# EAGLE design kid-v2 (EAGLE 9.1.3)
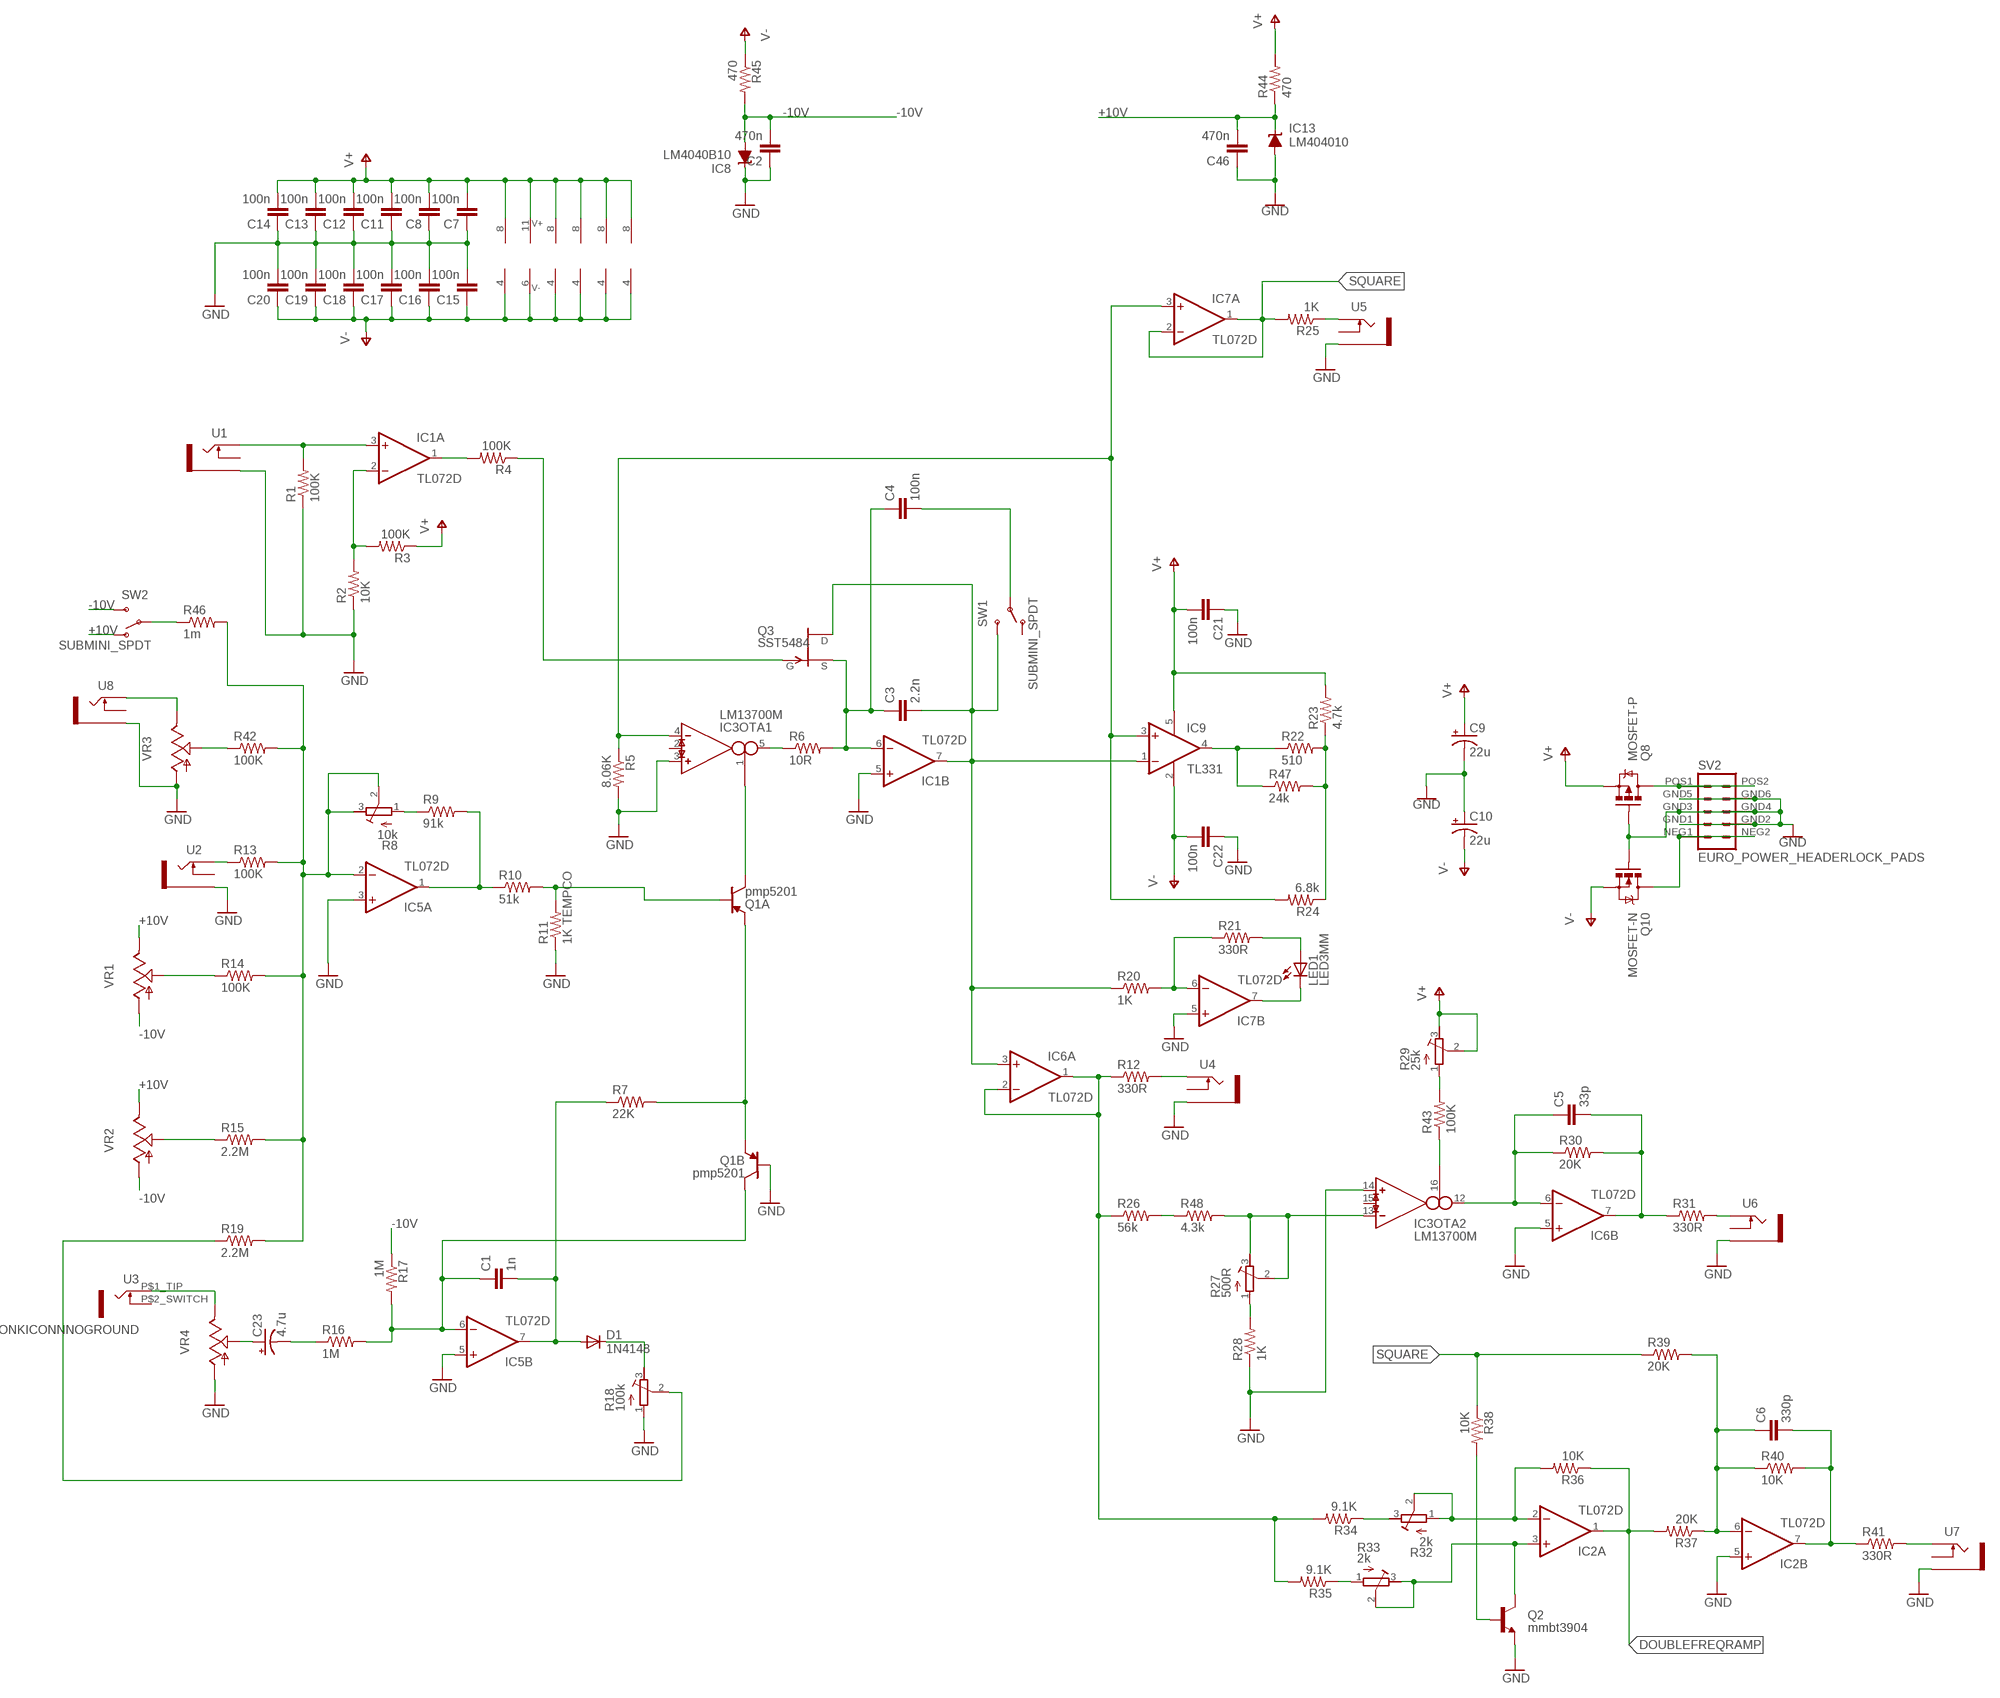
[diagram p0: schematic, sheet 1]

## Parts
C1  1n  C-EUC0603  [C0603]
C2  470n  CAP0603-CAP  [0603-CAP]
C3  2.2n  C-EUC0603  [C0603]
C4  100n  C-EUC0603  [C0603]
C5  33p  C-EUC0603  [C0603]
C6  330p  C-EUC0603  [C0603]
C7  100n  C-EUC0603  [C0603]
C8  100n  C-EUC0603  [C0603]
C9  22u  CPOL-USC  [PANASONIC_C]
C10  22u  CPOL-USC  [PANASONIC_C]
C11  100n  C-EUC0603  [C0603]
C12  100n  C-EUC0603  [C0603]
C13  100n  C-EUC0603  [C0603]
C14  100n  C-EUC0603  [C0603]
C15  100n  C-EUC0603  [C0603]
C16  100n  C-EUC0603  [C0603]
C17  100n  C-EUC0603  [C0603]
C18  100n  C-EUC0603  [C0603]
C19  100n  C-EUC0603  [C0603]
C20  100n  C-EUC0603  [C0603]
C21  100n  C-EUC0603  [C0603]
C22  100n  C-EUC0603  [C0603]
C23  4.7u  CPOL-USB  [PANASONIC_B]
C46  470n  CAP0603-CAP  [0603-CAP]
D1  1N4148  DIODESOD  [SOD-323]
IC1  TL072D  [SO08]
IC2  TL072D  [SO08]
IC3  LM13700M  [SO16]
IC5  TL072D  [SO08]
IC6  TL072D  [SO08]
IC7  TL072D  [SO08]
IC8  LM4040B10  LM4041B12DBZ  [DBZ_R-PDSO-G3]
IC9  TL331  [DBV-R-PDSO-G5]
IC13  LM404010  LM4041D12DBZ  [DBZ_R-PDSO-G3]
LED1  LED3MM  [LED3MM]
Q1  pmp5201  PNP-DUALPMP5201  [SOT363]
Q2  mmbt3904  TRANSISTOR_NPNSOT23  [SOT23]
Q3  SST5484  [SOT23]
Q8  MOSFET-P  [SOT23-3]
Q10  MOSFET-N  [SOT23-3]
R1  100K  R-US_R0603  [R0603]
R2  10K  R-US_R0603  [R0603]
R3  100K  R-US_R0603  [R0603]
R4  100K  R-US_R0603  [R0603]
R5  8.06K  R-US_R0603  [R0603]
R6  10R  R-US_R0603  [R0603]
R7  22K  R-US_R0603  [R0603]
R8  10k  R-TRIMM3296W  [RTRIM3296W]
R9  91k  R-US_R0603  [R0603]
R10  51k  R-US_R0603  [R0603]
R11  1K TEMPCO  R-US_R0805  [R0805]
R12  330R  R-US_R0603  [R0603]
R13  100K  R-US_R0603  [R0603]
R14  100K  R-US_R0603  [R0603]
R15  2.2M  R-US_R0603  [R0603]
R16  1M  R-US_R0603  [R0603]
R17  1M  R-US_R0603  [R0603]
R18  100k  R-TRIMM3296W  [RTRIM3296W]
R19  2.2M  R-US_R0603  [R0603]
R20  1K  R-US_R0603  [R0603]
R21  330R  R-US_R0603  [R0603]
R22  510  R-US_R0603  [R0603]
R23  4.7k  R-US_R0603  [R0603]
R24  6.8k  R-US_R0603  [R0603]
R25  1K  R-US_R0603  [R0603]
R26  56k  R-US_R0603  [R0603]
R27  500R  R-TRIMM3296W  [RTRIM3296W]
R28  1K  R-US_R0603  [R0603]
R29  25k  R-TRIMM3296W  [RTRIM3296W]
R30  20K  R-US_R0603  [R0603]
R31  330R  R-US_R0603  [R0603]
R32  2k  R-TRIMM3296W  [RTRIM3296W]
R33  2k  R-TRIMM3296W  [RTRIM3296W]
R34  9.1K  R-US_R0603  [R0603]
R35  9.1K  R-US_R0603  [R0603]
R36  10K  R-US_R0603  [R0603]
R37  20K  R-US_R0603  [R0603]
R38  10K  R-US_R0603  [R0603]
R39  20K  R-US_R0603  [R0603]
R40  10K  R-US_R0603  [R0603]
R41  330R  R-US_R0603  [R0603]
R42  100K  R-US_R0603  [R0603]
R43  100K  R-US_R0603  [R0603]
R44  470  RESISTOR0603-RES  [0603-RES]
R45  470  R-US_R0603  [R0603]
R46  1m  R-US_R0603  [R0603]
R47  24k  R-US_R0603  [R0603]
R48  4.3k  R-US_R0603  [R0603]
SV2  EURO_POWER_HEADERLOCK_PADS  [EURO_PWR_HEADER_LOCK]
SW1  SUBMINI_SPDT  [SUBMINI_TOGGLE]
SW2  SUBMINI_SPDT  [SUBMINI_TOGGLE]
U1  THONKICONNNEW  [WQP-PJ301M-12_JACK]
U2  THONKICONNNEW  [WQP-PJ301M-12_JACK]
U3  THONKICONNNOGROUND  [THONKICONNNOGROUND]
U4  THONKICONNNEW  [WQP-PJ301M-12_JACK]
U5  THONKICONNNEW  [WQP-PJ301M-12_JACK]
U6  THONKICONNNEW  [WQP-PJ301M-12_JACK]
U7  THONKICONNNEW  [WQP-PJ301M-12_JACK]
U8  THONKICONNNEW  [WQP-PJ301M-12_JACK]
VR1  9MM_SNAP-IN_POT_  [9MM_SNAP-IN_POT]
VR2  9MM_SNAP-IN_POT_  [9MM_SNAP-IN_POT]
VR3  9MM_SNAP-IN_POT_  [9MM_SNAP-IN_POT]
VR4  9MM_SNAP-IN_POT_  [9MM_SNAP-IN_POT]

## Nets
+10V: C46.2 IC13.1(C) R44.1 SW2.1(O) VR1.3(E) VR2.3(E)
-10V: C2.2 IC8.2(A) R17.1 R45.2 SW2.3(S) VR1.1(A) VR2.1(A)
DOUBLEFREQRAMP: IC2.1(A:OUT) R36.1 R37.2
GND: C2.1 C7.1 C8.1 C9.- C10.+ C11.1 C12.1 C13.1 C14.1 C15.2 C16.2 C17.2 C18.2 C19.2 C20.2 C21.1 C22.1 C46.1 IC1.5(B:+IN) IC2.5(B:+IN) IC3.3(OTA1:IN_P) IC3.14(OTA2:IN_P) IC5.3(A:+IN) IC5.5(B:+IN) IC6.5(B:+IN) IC7.5(B:+IN) IC8.1(C) IC13.2(A) Q1.P$2(B:B) Q2.2(E) Q8.1(G) Q10.1(G) R1.1 R2.1 R5.2 R11.1 R18.1(A) R28.1 SV2.GND1 SV2.GND2 SV2.GND3 SV2.GND4 SV2.GND5 SV2.GND6 U1.P$3_SLEEVE(SLEEVE) U2.P$3_SLEEVE(SLEEVE) U4.P$3_SLEEVE(SLEEVE) U5.P$3_SLEEVE(SLEEVE) U6.P$3_SLEEVE(SLEEVE) U7.P$3_SLEEVE(SLEEVE) U8.P$3_SLEEVE(SLEEVE) VR3.1(A) VR4.1(A)
N$1: IC1.3(A:+IN) R1.2 U1.P$1_TIP(TIP)
N$2: R26.2 R48.1
N$3: IC1.2(A:-IN) R2.2 R3.2
N$4: IC3.4(OTA1:IN_N) IC7.3(A:+IN) IC9.3(+IN) R5.1 R24.2
N$6: IC1.1(A:OUT) R4.2
N$7: IC3.5(OTA1:OUT) R6.1
N$8: C3.1 C4.1 IC1.6(B:-IN) Q3.2(S) R6.2
N$9: IC3.1(OTA1:I_BIAS) Q1.P$6(A:C)
N$10: Q1.P$4(B:E) Q1.P$5(A:E) R7.2
N$11: Q1.P$1(A:B) R10.2 R11.2
N$13: IC5.1(A:OUT) R9.2 R10.1
N$14: R15.1 VR2.2(S)
N$15: Q3.3(G) R4.1
N$16: R14.1 VR1.2(S)
N$17: R13.1 U2.P$1_TIP(TIP)
N$18: C1.1 IC5.6(B:-IN) Q1.P$3(B:C) R16.2 R17.2
N$19: C23.+ VR4.2(S)
N$20: C23.- R16.1
N$21: C1.2 D1.2(A) IC5.7(B:OUT) R7.1
N$22: D1.1(C) R18.3(E)
N$23: R18.2(S) R19.1
N$24: U3.P$1_TIP VR4.3(E)
N$25: C3.2 IC1.7(B:OUT) IC6.3(A:+IN) IC9.1(-IN) Q3.1(D) R20.1 SW1.3(S)
N$26: C4.2 SW1.COM(COMMON)
N$27: IC3.13(OTA2:IN_N) R27.2(S) R27.3(E) R48.2
N$28: IC6.1(A:OUT) IC6.2(A:-IN) R12.1 R26.1 R34.2 R35.2
N$29: R12.2 U4.P$1_TIP(TIP)
N$30: IC7.7(B:OUT) LED1.K(C)
N$31: IC7.6(B:-IN) R20.2 R21.1
N$32: LED1.A R21.2
N$33: R25.1 U5.P$1_TIP(TIP)
N$34: IC5.2(A:-IN) R8.2(S) R8.3(E) R13.2 R14.2 R15.2 R19.2 R42.2 R46.2
N$35: R22.2 R23.1 R24.1 R47.2
N$36: R27.1(A) R28.2
N$37: U8.P$1_TIP(TIP) VR3.3(E)
N$38: C5.1 IC3.12(OTA2:OUT) IC6.6(B:-IN) R30.1
N$39: R29.1(A) R43.2
N$40: R32.3(E) R34.1
N$41: R33.1(A) R35.1
N$42: C5.2 IC6.7(B:OUT) R30.2 R31.1
N$43: IC2.3(A:+IN) Q2.3(C) R33.2(S) R33.3(E)
N$44: R31.2 U6.P$1_TIP(TIP)
N$45: IC2.2(A:-IN) R32.1(A) R32.2(S) R36.2
N$48: Q2.1(B) R38.2
N$49: C6.2 IC2.7(B:OUT) R40.2 R41.1
N$50: R41.2 U7.P$1_TIP(TIP)
N$51: IC3.16(OTA2:I_BIAS) R43.1
N$52: R42.1 VR3.2(S)
N$53: R46.1 SW2.COM(COMMON)
N$54: IC9.4(OUT) R22.1 R47.1
N$55: Q8.3(D) SV2.POS1 SV2.POS2
N$56: R8.1(A) R9.1
N$58: Q10.3(D) SV2.NEG1 SV2.NEG2
REGSAW: C6.1 IC2.6(B:-IN) R37.1 R39.2 R40.1
SQUARE: IC7.1(A:OUT) IC7.2(A:-IN) R25.2 R38.1 R39.1
V+: C7.2 C8.2 C9.+ C11.2 C12.2 C13.2 C14.2 C21.2 IC1.8(P:V+) IC2.8(P:V+) IC3.11(SUPPLY:V+) IC5.8(P:V+) IC6.8(P:V+) IC7.8(P:V+) IC9.5(V+) Q8.2(S) R3.1 R23.2 R29.2(S) R29.3(E) R44.2
V-: C10.- C15.1 C16.1 C17.1 C18.1 C19.1 C20.1 C22.2 IC1.4(P:V-) IC2.4(P:V-) IC3.6(SUPPLY:V-) IC5.4(P:V-) IC6.4(P:V-) IC7.4(P:V-) IC9.2(GND) Q10.2(S) R45.1
Unconnected: IC3.2(OTA1:I_DIODE) IC3.7(BUF1:B) IC3.8(BUF1:E) IC3.9(BUF2:E) IC3.10(BUF2:B) IC3.15(OTA2:I_DIODE) SW1.1(O) U1.P$2_SWITCH(SWITCH) U2.P$2_SWITCH(SWITCH) U3.P$2_SWITCH U4.P$2_SWITCH(SWITCH) U5.P$2_SWITCH(SWITCH) U6.P$2_SWITCH(SWITCH) U7.P$2_SWITCH(SWITCH) U8.P$2_SWITCH(SWITCH)

## Library data of the parts
C1 C3-C8 C11-C22 = rcl:C-EU: CAPACITOR, European symbol; SPICEPREFIX: C
C2 C46 = SparkFun:CAP: Capacitor Standard 0603 ceramic capacitor, and 0.1" leaded capacitor.
C9 C10 C23 = rcl:CPOL-US: POLARIZED CAPACITOR, American symbol
D1 = SparkFun:DIODE: Diode These are standard reverse protection diodes and small signal diodes. SMA package can handle up to about 1A. SOD-323 can handle about 200mA. What the SOD-323 package when ordering, there are some mfgs out there that are 5-pin packages.
IC1 IC2 IC5-IC7 = gm-ics:TL072: OP AMP
IC3 = ota:LM13700: Dual OTA with buffers
IC8 = texas:LM4041: PRECISION MICROPOWER SHUNT VOLTAGE REFERENCE Source: http://focus.ti.com/lit/ds/slcs146e/slcs146e.pdf
IC9 = linear:TL331: SINGLE DIFFERENTIAL COMPARATOR Source: Data sheet <http://www.ti.com/lit/ds/symlink/tl331-q1.pdf>
IC13 = texas:LM4041: PRECISION MICROPOWER SHUNT VOLTAGE REFERENCE Source: http://focus.ti.com/lit/ds/slcs146e/slcs146e.pdf; MF: TEXAS INSTRUMENT CONNECTORS; MPN: LM4041D12QDBZT; OC_FARNELL: 1755118; OC_NEWARK: 43K3381
LED1 = audioint:LED
Q1 = audioint:PNP-DUAL
Q2 = SparkFun:TRANSISTOR_NPN: Transistor NPN BJT configuration in SOT23 package. MMBT2222 is the common NPN we use. Double check BCE configuration again layout.
Q3 = transistor-fet:?548*: N-Channel JFETs Source: VISHAY 2N5484.pdf Compatible: TO92 2N5245 J304 J305 U310 J308 J309 J310 TO72 2N4416 2N4416A 2N3823 2N4351 3N169 3N170 3N171 MFE3002 TO18 2N3796 2N3797 MFE825 Source: Motorola European Master Guide Pacge 3-59
Q8 = tc:MOSFET-P
Q10 = tc:MOSFET-N
R1-R7 R9-R17 R19-R26 R28 R30 R31 R34-R43 R46-R48 = rcl:R-US_: RESISTOR, American symbol; SPICEPREFIX: R
R8 R18 R27 R29 R32 R33 = rcl:R-TRIMM: Trimm resistor; SPICEMODEL: X; SPICEPREFIXL: POT
R44 = SparkFun:RESISTOR: Resistor Basic schematic elements and footprints for 0603, 1206, and PTH 1/10th watt (small) resistors.
R45 = rcl:R-US_: RESISTOR, American symbol
SV2 = MusicThingModular:EURO_POWER_HEADER: Power Header 10 pin power header for Eurorack Power Supplies Variants with fatter pads for easier soldering, and the LOCK variant which has 5mil offset pins to hold the component in place before soldering
SW1 SW2 = MusicThingModular:SUBMINI_SPDT
U1 U2 U4-U8 = MusicThingModular:THONKICONN: 3.5mm socket for Eurorack modular synths
U3 = tc:THONKICONNNOGROUND: Thonkiconn jack without ground tab
VR1-VR4 = MusicThingModular:9MM_SNAP-IN_POT: 9mm vertical snap-in pot, Alpha / Panasonic style

## Board
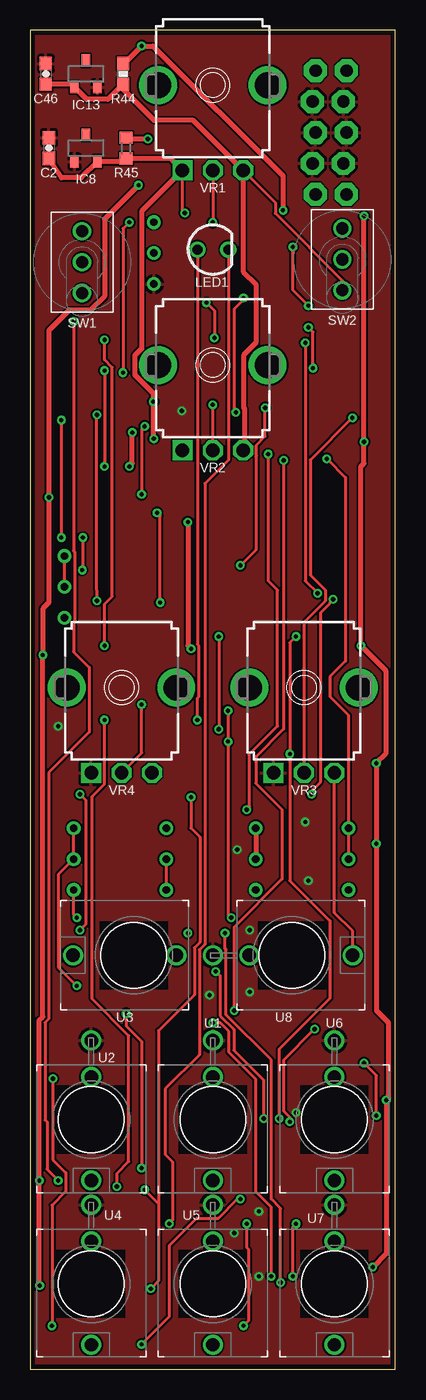
[diagram p1: board, top side]
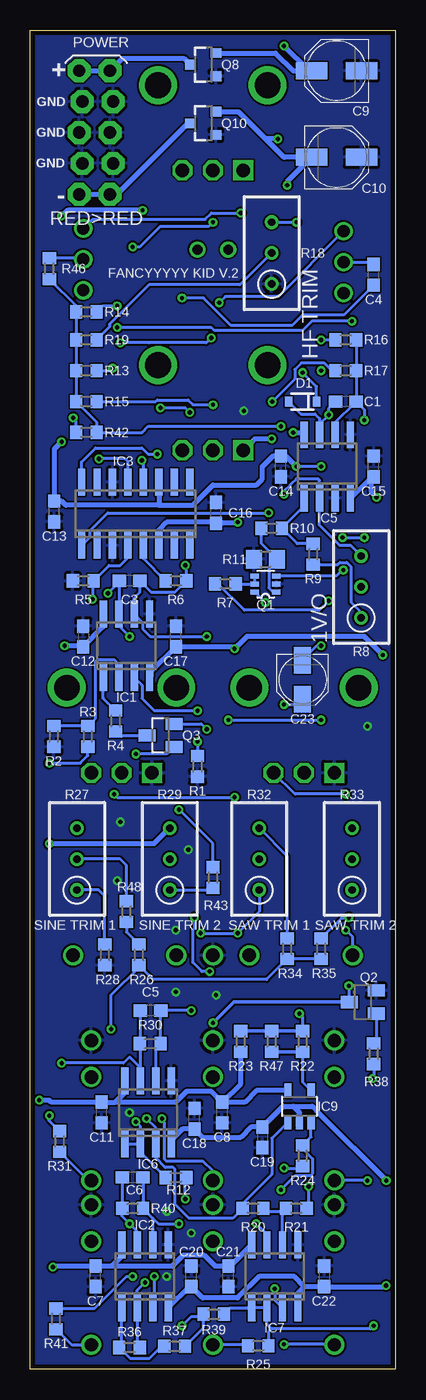
[diagram p2: board, bottom side, seen from below]

Size 30 x 110 mm. Coordinates in mm from the lower left corner, seen from the top.
Outline: 0,0 30,0 30,110 0,110 0,0
Copper layers (1*16): Top 0.0356mm / dielectric 1.5011mm / Bottom 0.0356mm
Design rules "LaenPCBOrder *": minimum track width 10mil, minimum drill 13mil, track to track 6mil, track to pad 6mil, pad to pad 6mil, via to via 6mil, smd to smd 6mil, copper to edge 15mil, drill to drill 6mil, minimum pad ring 10mil, minimum via ring 7mil, stop-mask expansion 3mil, vias tented up to drill 15mil, thermal gap 10mil

### Footprints (pad centres in the part's own frame; a part is rotated, then mirrored left to right if it is on the bottom)
C0603 = smd 1.1 x 1: 1 -0.85,0; 2 0.85,0
0603-CAP = smd 1.1 x 1: 1 -0.85,0; 2 0.85,0
PANASONIC_C = smd 2.6 x 1.4: + 2.05,0; - -2.05,0
PANASONIC_B = smd 2.2 x 1.4: + 1.6,0; - -1.6,0
SOD-323 = smd 0.63 x 0.83: 1 -1.15,0; 2 1.15,0
SO08 = smd 0.6 x 2.2: 1 -1.905,-2.6; 2 -0.635,-2.6; 3 0.635,-2.6; 4 1.905,-2.6; 5 1.905,2.6; 6 0.635,2.6; 7 -0.635,2.6; 8 -1.905,2.6
SO16 = smd 0.6 x 2.2: 1 -4.445,-2.6; 2 -3.175,-2.6; 3 -1.905,-2.6; 4 -0.635,-2.6; 5 0.635,-2.6; 6 1.905,-2.6; 7 3.175,-2.6; 8 4.445,-2.6; 9 4.445,2.6; 10 3.175,2.6; 11 1.905,2.6; 12 0.635,2.6; 13 -0.635,2.6; 14 -1.905,2.6; 15 -3.175,2.6; 16 -4.445,2.6
DBZ_R-PDSO-G3 = smd 0.7 x 1: 1 -0.95,-1.1; 2 0.95,-1.1; 3 0,1.1
DBV-R-PDSO-G5 = smd 0.6 x 1.2: 1 -0.95,-1.306; 2 0,-1.306; 3 0.95,-1.306; 4 0.95,1.306; 5 -0.95,1.306
LED3MM = drill 0.813: A -1.27,0; K 1.27,0
SOT363 = smd 0.42 x 0.7: P$1 -0.65,-0.9; P$2 0,-0.9; P$3 0.65,-0.9; P$4 0.65,0.9; P$5 0,0.9; P$6 -0.65,0.9
SOT23 = smd 1 x 1.4: 1 -0.95,-1.1; 2 0.95,-1.1; 3 0,1.1
SOT23-3 = smd 0.8 x 0.9: 1 -0.95,-1; 2 0.95,-1; 3 0,1.1
R0603 = smd 1 x 1.1: 1 -0.85,0; 2 0.85,0
RTRIM3296W = drill 0.61: 1 0,-2.54; 2 0,0; 3 0,2.54
R0805 = smd 1.3 x 1.5: 1 -0.95,0; 2 0.95,0
0603-RES = smd 1.1 x 1: 1 -0.85,0; 2 0.85,0
EURO_PWR_HEADER_LOCK = drill 1.016 pad 1.88 octagon: GND1 -2.54,1.143; GND2 -2.54,-1.397; GND3 0,1.397; GND4 0,-1.143; GND5 2.54,1.143; GND6 2.54,-1.397; NEG1 -5.08,1.397; NEG2 -5.08,-1.143; POS1 5.08,1.397; POS2 5.08,-1.143
SUBMINI_TOGGLE = drill 1 pad 1.422: 1 -2.54,0; 3 2.54,0; COM 0,0
WQP-PJ301M-12_JACK = drill 1.1: P$1_TIP 0,5; P$2_SWITCH 0,-3.5; P$3_SLEEVE 0,-6.5
THONKICONNNOGROUND = drill 1.1: P$1_TIP 0,5; P$2_SWITCH 0,-3.5
9MM_SNAP-IN_POT = drill 1.1 square: 1 -2.5,-7 | drill 1.1 octagon: 2 0,-7; 3 2.5,-7 | drill 2.1 pad 2.794: CHASSIS1 -4.5,0; CHASSIS2 4.5,0

### Placement (x,y rotation side)
C1  4.06,79.5 180 bottom
C2  1.52,100.33 270 top
C3  21.84,64.77 180 bottom
C4  1.78,89.92 90 bottom
C5  20.12,29.45 180 bottom
C6  21.59,15.75 180 bottom
C7  24.64,7.62 90 bottom
C8  14.22,21.08 90 bottom
C9  4.83,106.68 180 bottom
C10  4.83,99.57 0 bottom
C11  24.13,21.08 90 bottom
C12  25.65,60.2 270 bottom
C13  28.03,70.47 90 bottom
C14  9.4,74.17 90 bottom
C15  1.78,74.17 90 bottom
C16  14.73,70.36 90 bottom
C17  18.03,60.2 90 bottom
C18  16.51,20.57 90 bottom
C19  10.92,19.05 270 bottom
C20  16.76,7.62 90 bottom
C21  13.72,7.62 90 bottom
C22  5.84,7.62 270 bottom
C23  7.62,56.64 270 bottom
C46  1.27,106.43 270 top
D1  7.62,79.5 180 bottom
IC1  22.1,59.44 0 bottom
IC2  20.57,7.62 0 bottom
IC3  21.34,70.29 0 bottom
IC5  5.59,74.17 0 bottom
IC6  20.32,21.08 0 bottom
IC7  9.91,7.62 0 bottom
IC8  4.57,100.33 0 top
IC9  7.87,21.59 0 bottom
IC13  4.57,106.43 0 top
LED1  15,92 0 top
Q1  10.67,64.52 90 bottom
Q2  2.67,30.16 90 bottom
Q3  19.3,52.07 90 bottom
Q8  15.75,107.19 90 bottom
Q10  15.75,102.36 90 bottom
R1  16.26,49.53 90 bottom
R2  28.08,51.98 90 bottom
R3  25.28,51.98 90 bottom
R4  23,53.25 90 bottom
R5  25.65,64.77 180 bottom
R6  18.03,64.77 0 bottom
R7  13.97,64.52 0 bottom
R8  2.79,64.27 0 bottom
R9  6.74,66.97 90 bottom
R10  10.16,69.09 180 bottom
R11  10.67,66.55 0 bottom
R12  18.03,15.75 0 bottom
R13  25.4,82.04 180 bottom
R14  25.4,86.87 180 bottom
R15  25.4,79.5 180 bottom
R16  4.06,84.58 0 bottom
R17  4.06,82.04 0 bottom
R18  10.16,91.7 0 bottom
R19  25.4,84.58 180 bottom
R20  11.68,13.21 0 bottom
R21  8.13,13.21 0 bottom
R22  7.62,26.92 90 bottom
R23  12.7,26.92 270 bottom
R24  7.62,17.53 90 bottom
R25  11.26,1.91 0 bottom
R26  21.08,34.04 90 bottom
R27  26.16,41.91 0 bottom
R28  23.88,34.04 90 bottom
R29  18.54,41.91 0 bottom
R30  20.15,26.74 180 bottom
R31  27.59,18.71 270 bottom
R32  11.18,41.91 0 bottom
R33  3.56,41.91 0 bottom
R34  8.89,34.54 270 bottom
R35  6.1,34.54 270 bottom
R36  21.84,1.78 0 bottom
R37  18.14,1.87 180 bottom
R38  1.78,25.91 90 bottom
R39  14.92,4.51 180 bottom
R40  21.59,13.21 180 bottom
R41  27.89,4.13 270 bottom
R42  25.4,76.96 0 bottom
R43  14.99,40.39 270 bottom
R44  7.62,106.43 90 top
R45  7.87,100.33 270 top
R46  28.45,90.42 270 bottom
R47  10.16,26.92 90 bottom
R48  22.1,37.59 90 bottom
SV2  24.59,101.61 90 bottom
SW1  4.25,90.96 90 top
SW2  25.65,91.19 90 top
U1  15,20.5 180 top
U2  5,20.5 180 top
U3  8.5,34 90 top
U4  5,7 180 top
U5  15,7 180 top
U6  25,20.5 180 top
U7  25,7 180 top
U8  21.5,34 270 top
VR1  15,105.5 0 top
VR2  15,82.5 0 top
VR3  22.5,56 0 top
VR4  7.5,56 0 top

### Tracks (layer width: path | path; a pad name or v marks a point on that pad's centre or on a via)
+10V
  Top 0.254: VR1.3 20.14,95.86 20.14,94.96 25.65,89.45 SW2.1
  Top 0.406: VR2.3 17.61,75.61 17.61,78.91 17.53,78.99 17.53,83.31 18.54,84.33 18.54,89.15 17.5,90.2 VR1.3 13.38,102.62 10.16,102.62 7.62,105.16 R44.1 6.37,104.33 4.62,104.33 IC13.1 3.37,105.58 C46.2
-10V  (via drill 0.35)
  Top 0.254: v12.7,95 12.5,95.2 VR1.1
  Top 0.406: v10.16,76.45 10.11,76.51 v10.11,79.5 10.11,80.19 8.59,81.71 8.59,83.29 9.14,83.85 9.14,95.14 VR1.1 11.52,99.48 R45.2 7.62,99.23 IC8.2 4.18,97.89 2.56,97.89 C2.2
  Bottom 0.254: v12.7,95 15.12,95 15.63,94.49 24.89,94.49 SW2.3 | R17.1 5.2,82.04 5.83,82.67 7.72,82.67 8.25,82.15 8.25,81.36 v10.11,79.5
  Bottom 0.406: VR2.1 11.55,76.45 v10.16,76.45
DOUBLEFREQRAMP
  Bottom 0.254: R37.2 19.21,1.87 20.23,0.85 21.77,0.85 R36.1 22.48,1.99 IC2.1
GND  (via drill 0.35)
  other vias: 18.03,30.99 21.84,21.08 18.8,7.62 18.8,12.95 16.76,11.18 14.73,30.73 18.03,36.07 22.86,40.13 22.61,44.96 17.02,42.67 2.29,52.83 12.45,78.74
  pour Bottom: 37,120 36.75,-10.25 -10.25,-10.25 -10,120
  pour Top: 35,115 35,-5 -9.32,-4.75 -9.32,115.25
N$1  (via drill 0.35)
  Top 0.254: v16.26,54.1 v16.26,51.56 16.26,37.34 v16.51,37.08 | v15.24,32.67 15.6,32.31 15.6,29.04 16.73,27.91 16.73,26.2 19.18,23.75 v19.18,20.57
  Bottom 0.254: v16.26,51.56 R1.2 | IC1.3 20.83,56.2 20.83,55.12 19.81,54.1 v16.26,54.1 | v16.51,37.08 16.51,36.2 16.63,36.08 16.63,33.4 15.91,32.67 v15.24,32.67 | U1.P$1_TIP 15,16.27 15.83,17.1 18.83,17.1 18.99,17.27 18.99,20.26 19.18,20.45 v19.18,20.57
N$2
  Bottom 0.254: R48.1 22.1,35.9 R26.2
N$3
  Bottom 0.254: R2.2 R3.2 24.64,53.48 24.64,58.17 24.51,58.29 23.11,58.29 22.73,57.91 IC1.2
N$4  (via drill 0.35)
  Top 0.254: v24.89,63.25 24.66,63.02 24.66,62.95 23.88,62.16 23.88,48.26 23.11,47.5 v23.11,47.24 | v13.21,46.99 13.21,44.45 13.94,43.72 13.94,35.08 13.49,34.63 13.49,30.76 10.54,27.81 10.54,13.59 | v9.91,6.6 10.54,7.23 10.54,13.59 | v9.4,14.73 10.54,13.59
  Bottom 0.254: IC3.4 21.98,66.67 22.61,66.04 23.53,66.04 R5.1 24.89,64.68 v24.89,63.25 | v23.11,47.24 22.86,46.99 v13.21,46.99 | v9.91,6.6 9.91,5.66 IC7.3 | v9.4,14.73 8.23,15.9 6.95,15.9 6.79,16.06 6.79,17.29 7.62,18.12 R24.2 6.92,19.07 IC9.3
N$6
  Bottom 0.254: R4.2 24,55.11 IC1.1
N$7
  Bottom 0.254: R6.1 20.71,66.59 IC3.5
N$8  (via drill 0.35)
  Top 0.254: v17.53,88.01 17.53,87.88 16.76,87.12 16.76,78.75 v16.9,78.62 | v17.27,66.04 18.54,67.31 18.54,74.98 18.6,75.04 18.6,75.95 19.3,76.65 v19.3,78.99 | v15.49,60.2 v15.49,52.58
  Bottom 0.254: v17.53,88.01 15.75,88.01 13.49,85.75 8.48,85.75 7.62,86.61 4.23,86.61 C4.1 | v17.27,66.04 17.18,65.95 R6.2 18.11,63.84 20.07,63.84 C3.1 20.99,63.84 21.46,63.37 IC1.6 20.77,61.34 20.77,60.82 20.15,60.2 v15.49,60.2 | v19.3,78.99 17.28,78.99 v16.9,78.62 | Q3.2 15.94,53.02 v15.49,52.58
N$9  (via drill 0.35)
  Top 0.254: v10.67,62.99 10.67,70.1 v10.41,70.36
  Bottom 0.254: IC3.1 25.1,68.38 25.1,68.9 23.64,70.36 v10.41,70.36 | Q1.P$6 11.54,63.87 v10.67,62.99
N$10
  Bottom 0.254: Q1.P$4 Q1.P$5 R7.2
N$11
  Bottom 0.254: Q1.P$1 10.07,63.87 10.4,64.19 10.4,65.87 R11.2 11.01,67.84 R10.2
N$13
  Bottom 0.254: R9.2 8.04,67.82 R10.1 7.49,70.91 IC5.1
N$14  (via drill 0.35)
  Top 0.254: v14.99,79.25 14.99,75.51 VR2.2
  Bottom 0.254: v14.99,79.25 16.64,79.25 17.02,79.63 19.57,79.63 19.69,79.5 R15.1
N$15
  Bottom 0.254: R4.1 22.66,52.07 Q3.3
N$16  (via drill 0.35)
  Top 0.254: v22.86,87.38 21.59,88.66 v21.59,92.2 | VR1.2 15,94.25 v14.99,94.23
  Bottom 0.254: R14.1 24.04,87.38 v22.86,87.38 | v14.99,94.23 15.34,93.88 19.33,93.88 21,92.2 v21.59,92.2
N$17  (via drill 0.35)
  Top 0.254: v23.24,82.25 23.24,85.22 v22.86,85.6 | v2.29,15.49 1.37,16.41 1.37,20.33 1.22,20.48 1.22,28.47 1.52,28.78 1.52,49.02 4.84,52.34 4.84,57.66 3.56,58.94 3.56,61.31 3.63,61.38 3.63,67.16 3.56,67.23 v3.56,86.11
  Bottom 0.254: v2.29,15.49 v2.29,15.5 U2.P$1_TIP | v3.56,86.11 6.86,86.11 7.62,85.34 14.85,85.34 15.11,85.6 v22.86,85.6 | R13.1 23.45,82.04 v23.24,82.25
N$18  (via drill 0.35)
  Top 0.254: v2.54,77.98 v2.54,68.33 | v4.26,65.66 4.32,65.71 v4.32,68.33
  Bottom 0.254: R16.2 R17.2 C1.1 | C1.1 2.54,78.83 v2.54,77.98 | IC5.6 4.95,77.76 C1.1 | v4.32,68.33 v2.54,68.33 | v4.26,65.66 4.33,65.66 4.83,65.17 Q1.P$3
N$19  (via drill 0.35)
  Top 0.254: VR4.2 9.14,50.64 v9.14,54.61
  Bottom 0.254: v9.14,54.61 8.05,54.61 C23.+
N$20  (via drill 0.35)
  Top 0.254: v6.1,59.44 6.1,62.86 6.73,63.49 6.73,82.3 6.1,82.94 v6.1,84.58
  Bottom 0.254: C23.- 6.43,59.44 v6.1,59.44 | v6.1,84.58 R16.1
N$21  (via drill 0.35)
  Top 0.254: v5.46,78.4 5.46,64.01 5.47,64 v5.47,63.13
  Bottom 0.254: C1.2 5.46,78.95 v5.46,78.4 6.22,77.64 IC5.7 6.22,78.11 6.6,78.49 7.75,78.49 D1.2 | v5.47,63.13 6.24,62.36 12.41,62.36 14.56,64.52 R7.1
N$22  (via drill 0.35)
  Top 0.254: v8.13,94.23 7.62,93.73 v7.62,81.88
  Bottom 0.254: D1.1 6.47,80.73 v7.62,81.88 | R18.3 v8.13,94.23
N$23
  Bottom 0.254: R19.1 23.49,85.64 23.49,85.86 20.26,89.09 12.77,89.09 R18.2
N$24  (via drill 0.35)
  Top 0.254: v4.06,36.07 4.57,36.58 4.57,46.74 v4.06,47.24
  Bottom 0.254: U3.P$1_TIP 3.5,35.5 v4.06,36.07 | v4.06,47.24 8.24,47.24 VR4.3
N$25  (via drill 0.35)
  Top 0.254: v22.61,84.33 22.61,64.77 v23.62,63.75 | v14.48,87.63 15.13,86.97 v15.13,84.73 | v21.84,60.2 21.34,59.69 v21.34,50.55 21.34,40.13 24.64,36.83 24.64,30.48 20.44,26.29 v20.44,20.57
  Bottom 0.254: v22.61,84.33 20.27,84.33 20.26,84.34 15.53,84.34 v15.13,84.73 | v23.62,63.75 22.69,64.68 C3.2 22.69,62.08 IC1.7 22.73,61.09 v21.84,60.2 | v14.48,87.63 13.97,88.14 9.61,88.14 SW1.3 | v20.44,20.57 19.68,19.82 IC6.3 19.68,17.34 18.92,16.58 18.27,16.58 18.11,16.41 18.11,13.53 16.97,12.4 13.35,12.4 R20.1 12.53,13.63 10.14,16.02 10.14,18.96 IC9.1 | Q3.1 18.78,50.55 v21.34,50.55
N$26
  Bottom 0.254: SW1.COM 1.97,90.96 C4.2
N$27  (via drill 0.35)
  Top 0.254: v24.38,74.81 25.91,73.27 25.91,58.17 24.64,56.9 24.64,55.26 26.16,53.74 R27.3 R27.2
  Bottom 0.254: IC3.13 21.98,74.56 22.23,74.81 v24.38,74.81 | R27.2 22.61,41.91 22.1,41.4 R48.2
N$28  (via drill 0.35)
  Top 0.254: v21.34,20.32 21.34,20.7 20.85,21.18 20.85,25.42 v23.37,27.94
  Bottom 0.254: R35.2 R34.2 10.58,32 19.9,32 21,33.1 | 21,33.1 R26.1 | IC6.2 IC6.1 | IC6.2 20.95,19.94 v21.34,20.32 | v23.37,27.94 23.37,30.73 21,33.1 | IC6.2 20.95,17.82 R12.1
N$29  (via drill 0.35)
  Top 0.254: v9.14,2.03 11.43,4.32 11.43,10.16 13.67,12.4 15.46,12.4 17.03,13.97 v17.27,13.97
  Bottom 0.254: U4.P$1_TIP 5.03,2.03 v9.14,2.03 | v17.27,13.97 17.27,15.66 R12.2
N$30  (via drill 0.35)
  Top 0.254: v11.42,11.95 11.68,12.21 11.68,17.03 11.07,17.64 11.07,23.01 13.9,25.83 13.9,34.46 14.35,34.91 14.35,72.77 16.27,74.69 LED1.K
  Bottom 0.254: v11.42,11.95 10.54,11.06 IC7.7
N$31
  Bottom 0.254: IC7.6 9.27,12.66 R21.1 9.18,12.98 10.61,12.98 R20.2
N$32  (via drill 0.35)
  Top 0.254: v13.72,53.34 13.72,55.12 13.84,55.24 13.84,59.44 13.73,59.55 LED1.A | v6.1,53.34 6.1,49.95 6.1,49.94 6.1,48.06 5.08,47.03 5.08,30.41 8.1,27.4 8.1,17.05 7.11,16.07 v7.11,14.99
  Bottom 0.254: v13.72,53.34 v6.1,53.34 | R21.2 7.11,13.37 v7.11,14.99
N$33
  Bottom 0.254: R25.1 12.2,2 U5.P$1_TIP
N$34  (via drill 0.35)
  Top 0.254: v9.4,77.47 9.14,77.22 v9.14,71.88 | R8.3 R8.2
  Bottom 0.254: v9.4,77.47 20.32,77.47 20.83,76.96 R42.2 24.55,77.8 R15.2 R13.2 R19.2 R14.2 26.25,87.38 R46.2 | v9.14,71.88 9.14,72.13 8.62,72.65 8.62,72.66 8.13,73.15 6.35,73.15 6.22,73.03 IC5.2 6.22,69.34 4.58,67.69 3.68,67.69 R8.3
N$35  (via drill 0.35)
  Top 0.254: v7.87,29.21 7.87,28.19 9.14,26.92 v9.14,16.51
  Bottom 0.254: v9.14,16.51 7.79,16.51 R24.1 | v7.87,29.21 7.62,28.96 R22.2
  Bottom 0.305: R23.1 R47.2 R22.2
N$36
  Bottom 0.254: R28.2 23.88,38.86 24.38,39.37 R27.1
N$37
  Top 0.254: U8.P$1_TIP 26.5,35.98 25,37.48 VR3.3
N$38  (via drill 0.35)
  Top 0.254: v16.76,29.46 16.76,36.32 20.7,40.26 20.7,45.97 18.54,48.14 18.54,50.29 20.83,52.58 v20.83,74.68
  Bottom 0.254: IC3.12 20.71,74.56 v20.83,74.68 | v16.76,29.46 19.26,29.46 C5.1 19.3,29.42 R30.1 19.68,26.35 IC6.6
N$39
  Bottom 0.254: R29.1 15.15,39.37 R43.2
N$40
  Bottom 0.254: R32.3 8.89,42.16 R34.1
N$41  (via drill 0.35)
  Top 0.254: v3.81,37.08 3.56,37.34 R33.1
  Bottom 0.254: R35.1 4.41,37.08 v3.81,37.08
N$42  (via drill 0.35)
  Top 0.254: v28.45,20.83 28.45,24.13 v27.43,25.15
  Bottom 0.254: C5.2 20.97,26.77 R30.2 21,23.73 IC6.7 20.95,24.77 21.84,25.65 22.35,25.15 v27.43,25.15 | R31.1 28.45,20.42 v28.45,20.83
N$43  (via drill 0.35)
  Top 0.254: R33.3 R33.2 2.29,40.64 2.29,33.02 v3.81,31.5 | v14.99,28.45 15.62,28.45 16.32,27.74 16.32,26.03 18.54,23.81 18.54,14.58 19.81,13.31 v19.81,7.62
  Bottom 0.254: v3.81,31.5 3.81,30.2 Q2.3 | v19.81,7.62 19.81,5.15 IC2.3
  Bottom 0.305: v14.99,28.45 13.28,30.16 Q2.3
N$44
  Bottom 0.254: R31.2 25.23,15.5 U6.P$1_TIP
N$45  (via drill 0.35)
  Top 0.254: v16,35.81 16,34.56 16.1,34.46 16.1,29.11 19.81,25.4 19.81,13.97 20.57,13.21 v20.57,7.11 | R32.2 R32.1
  Bottom 0.254: R36.2 21.21,1.99 IC2.2 21.21,6.48 v20.57,7.11 | R32.1 11.18,37.59 v12.95,35.81 v16,35.81
N$48
  Bottom 0.254: Q2.1 1.57,26.97 R38.2
N$49  (via drill 0.35)
  Top 0.254: v21.59,7.62 21.59,11.68 v21.84,11.94
  Bottom 0.254: C6.2 R40.2 22.44,12.53 v21.84,11.94 21.21,11.3 IC2.7 | v21.59,7.62 22.1,7.62 24.74,4.98 R41.1
N$50
  Bottom 0.254: R41.2 26.61,2 U7.P$1_TIP
N$51  (via drill 0.35)
  Top 0.254: v17.78,45.97 18.03,46.23 18.03,50.55 20.32,52.83 20.32,64.01 19.56,64.77 v19.56,75.18
  Bottom 0.254: R43.1 14.99,43.18 v17.78,45.97 | v19.56,75.18 20.32,75.18 20.83,75.69 24.64,75.69 25.79,74.54 IC3.16
N$52  (via drill 0.35)
  Top 0.254: v26.48,78.17 23.01,74.7 23.01,65.26 24.25,64.02 24.25,63.12 22.5,61.36 VR3.2
  Bottom 0.254: R42.1 26.25,77.93 v26.48,78.17
N$53
  Bottom 0.254: SW2.COM 25.74,91.27 R46.1
N$54
  Bottom 0.254: R22.1 7.62,23.59 IC9.4
  Bottom 0.305: R47.1 R22.1
N$55
  Bottom 0.406: SV2.POS1 SV2.POS2 22.43,107.71 17.37,107.71 Q8.3
N$56
  Bottom 0.254: R8.1 2.79,62.17 3.63,63.01 3.63,65.93 3.99,66.29 4.53,66.29 4.7,66.12 R9.1
N$58
  Bottom 0.406: SV2.NEG1 SV2.NEG2 22.85,96.53 17.02,102.36 Q10.3
REGSAW  (via drill 0.35)
  Top 0.254: v17.78,11.94 17.78,10 17.93,9.85 17.93,3.96 v17.53,3.56
  Bottom 0.254: R37.1 15.77,3.4 15.77,4.32 | 15.77,4.32 R39.2 | C6.1 R40.1 19.94,12.41 | 19.94,12.41 IC2.6 | 19.94,12.41 19.47,11.94 v17.78,11.94 | v17.53,3.56 16.76,4.32 15.77,4.32
SQUARE  (via drill 0.35)
  Top 0.254: v1.85,23.88 1.85,17.2 2.92,16.13 2.92,14.6 1.78,13.46 v1.78,3.56
  Bottom 0.254: R38.1 1.78,23.95 v1.85,23.88 | v1.78,3.56 2.03,3.3 10.16,3.3 | 10.16,3.3 10.41,3.05 R25.2 | 10.16,3.3 10.54,3.68 IC7.2 IC7.1 13.56,5.02 R39.1
V+  (via drill 0.35)
  Top 0.254: v6.1,82.04 v6.1,74.17
  Top 0.406: v8.13,74.17 8.38,74.42 v8.38,76.96 | R29.3 R29.2 | v27.43,94.74 v27.43,76.2 27.43,74.42 27.18,74.17 v27.18,59.44 29.21,57.4 29.21,50.55 v28.45,49.78 v28.45,43.18 28.45,29.46 29.42,28.5 29.42,22.25 v29.27,22.1 29.27,9.49 v28.15,8.38 | R44.2 7.87,107.44 v9.14,108.71 10.11,108.71 20.77,98.04 v20.77,95.22
  Bottom 0.254: v6.1,74.17 v8.13,74.17 | v28.45,49.78 25.91,49.78 25.28,50.41 R3.1
  Bottom 0.406: v9.14,108.71 7.11,106.68 C9.+ 8.38,106.68 9.84,108.14 Q8.2 | v27.43,76.2 28.03,75.6 C13.2 27.43,71.32 27.09,70.99 19.44,70.99 | v8.13,74.17 8.98,75.02 C14.2 10.07,75.02 10.92,74.17 10.92,73.15 11.43,72.64 14.99,72.64 16.64,70.99 19.44,70.99 | v8.38,76.96 7.69,76.96 IC5.8 | v27.18,59.44 25.74,59.44 C12.2 24,61 IC1.8 | R29.3 19.81,43.18 v28.45,43.18 | IC6.8 22.23,22.99 22.1,22.86 23.03,21.93 | 23.03,21.93 C11.2 28.28,21.93 28.45,22.1 v29.27,22.1 | 23.03,21.93 18.06,21.93 17.18,22.82 15.11,22.82 C8.2 | C8.2 12.36,21.93 11.39,22.9 IC9.5 | v28.15,8.38 28.07,8.47 C7.2 23.28,8.47 | IC2.8 22.48,9.27 23.28,8.47 | 23.28,8.47 18.32,8.47 17.41,9.38 15.73,9.38 14.82,8.47 C21.2 13.56,8.47 IC7.8 | IC3.11 19.44,70.99 | v27.43,94.74 26.95,95.22 v20.77,95.22 | C8.2 12.7,23.46 R23.2
V-  (via drill 0.35)
  Top 0.406: v12.95,69.6 12.95,59.44 v13.21,59.18 | v0.76,6.86 0.73,6.89 v0.73,15.49 0.73,28.67 1.02,28.96 v1.02,58.67 1.02,62.48 1.52,62.99 v1.52,71.63 1.52,85.34 3.17,87 4.95,87 6.1,88.14 6.1,94.49 v8.89,97.28 | R45.1 7.96,101.09 v9.65,101.09
  Bottom 0.406: 1.94,73.15 C15.1 | v12.95,69.6 13.04,69.51 14.22,69.51 | 14.22,69.51 C16.1 | 14.22,69.51 14.31,69.6 18.8,69.6 19.44,68.95 IC3.6 | IC1.4 20.07,56.96 20.07,57.32 C17.1 13.37,59.35 v13.21,59.18 12.19,60.2 2.54,60.2 v1.02,58.67 | IC6.4 18.41,18.8 17.49,19.72 C18.1 15.84,19.05 12.7,19.05 11.85,19.9 C19.1 9.23,21.59 8.38,21.59 | 7.45,6.77 C22.2 0.85,6.77 v0.76,6.86 | IC7.4 8,6.22 7.45,6.77 | v1.52,71.63 1.94,72.05 1.94,73.15 | 7.45,6.77 8.3,7.62 11.18,7.62 12.95,5.84 15.84,5.84 C20.1 16.92,6.77 IC2.4 | v8.89,97.28 8.89,97.55 C10.- 9.14,99.57 10.67,101.09 | IC5.4 2.1,73.15 1.94,73.15 | 8.38,21.59 7.87,21.08 IC9.2 | v0.73,15.49 6.27,21.03 6.83,21.59 8.38,21.59 | Q10.2 12.89,103.31 10.67,101.09 | v9.65,101.09 10.67,101.09

### Text on the board
bNames: HF TRIM | FANCYYYYY KID V.2 | 1V/O | SAW TRIM 2 | SAW TRIM 1 | SINE TRIM 2 | SINE TRIM 1